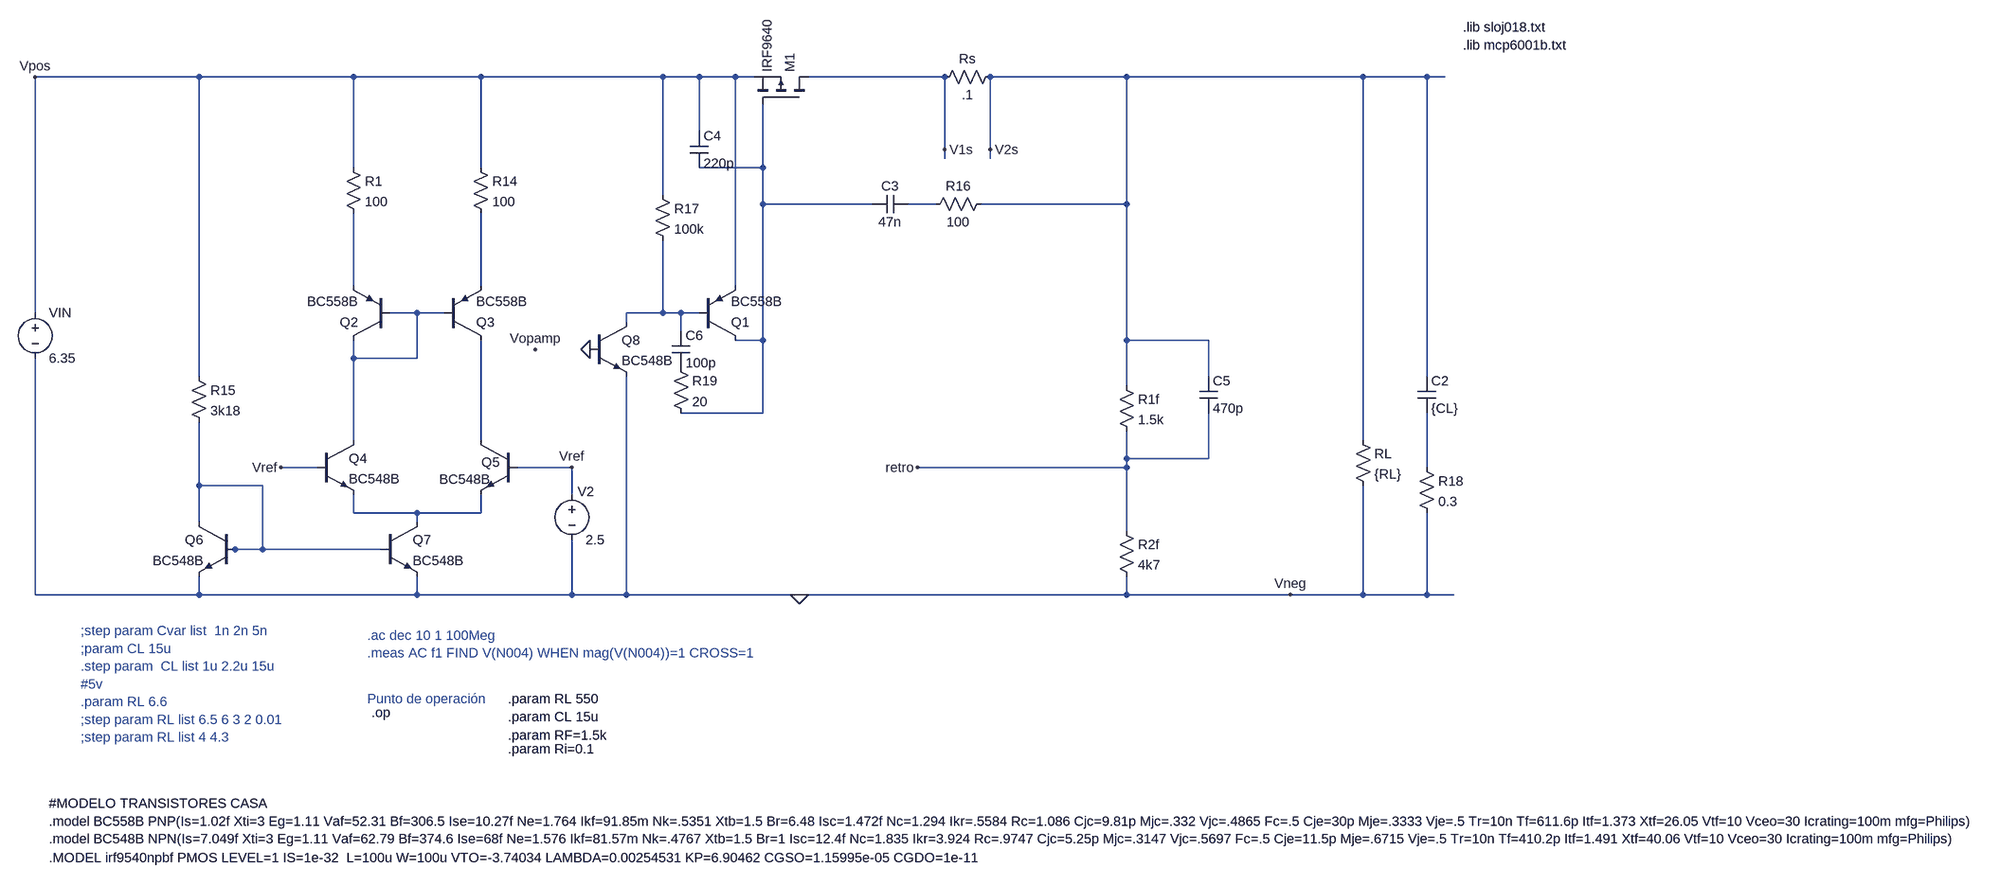
[diagram p0: schematic 2024-10-15 prueba vref caso limite2.asc]
2024-10-15 prueba vref caso limite2.asc, the LTspice schematic file:
Version 4
SHEET 1 6700 2000
WIRE -496 -32 -784 -32
WIRE -224 -32 -496 -32
WIRE 0 -32 -224 -32
WIRE 320 -32 0 -32
WIRE 384 -32 320 -32
WIRE 448 -32 384 -32
WIRE 480 -32 448 -32
WIRE 816 -32 576 -32
WIRE 1136 -32 896 -32
WIRE 1552 -32 1136 -32
WIRE 1664 -32 1552 -32
WIRE 1696 -32 1664 -32
WIRE 384 64 384 -32
WIRE 816 96 816 -32
WIRE 896 96 896 -32
WIRE 816 112 816 96
WIRE 896 112 896 96
WIRE -224 128 -224 -32
WIRE 0 128 0 -32
WIRE 496 128 496 16
WIRE 496 128 384 128
WIRE 320 176 320 -32
WIRE 496 192 496 128
WIRE 688 192 496 192
WIRE 800 192 752 192
WIRE 1136 192 1136 -32
WIRE 1136 192 880 192
WIRE -224 336 -224 208
WIRE 0 336 0 208
WIRE 448 336 448 -32
WIRE -784 384 -784 -32
WIRE -112 384 -160 384
WIRE -64 384 -112 384
WIRE 320 384 320 256
WIRE 320 384 256 384
WIRE 352 384 320 384
WIRE 384 384 352 384
WIRE 256 400 256 384
WIRE 352 416 352 384
WIRE 496 432 496 192
WIRE 496 432 448 432
WIRE 1136 432 1136 192
WIRE 1280 432 1136 432
WIRE 208 448 192 448
WIRE -224 464 -224 432
WIRE -112 464 -112 384
WIRE -112 464 -224 464
WIRE -496 496 -496 -32
WIRE 1280 496 1280 432
WIRE 1664 496 1664 -32
WIRE 1136 512 1136 432
WIRE 496 560 496 432
WIRE 496 560 352 560
WIRE -224 608 -224 464
WIRE 0 608 0 432
WIRE 1552 608 1552 -32
WIRE 1136 640 1136 592
WIRE 1280 640 1280 560
WIRE 1280 640 1136 640
WIRE -288 656 -352 656
WIRE 160 656 64 656
WIRE 1136 656 1136 640
WIRE 1136 656 768 656
WIRE 1664 656 1664 560
WIRE -496 688 -496 576
WIRE -384 688 -496 688
WIRE 160 704 160 656
WIRE -224 736 -224 704
WIRE -112 736 -224 736
WIRE 0 736 0 704
WIRE 0 736 -112 736
WIRE -496 752 -496 688
WIRE -112 752 -112 736
WIRE 1136 768 1136 656
WIRE -432 800 -448 800
WIRE -384 800 -384 688
WIRE -384 800 -432 800
WIRE -176 800 -384 800
WIRE -784 880 -784 464
WIRE -496 880 -496 848
WIRE -496 880 -784 880
WIRE -112 880 -112 848
WIRE -112 880 -496 880
WIRE 160 880 160 784
WIRE 160 880 -112 880
WIRE 256 880 256 496
WIRE 256 880 160 880
WIRE 560 880 256 880
WIRE 1136 880 1136 848
WIRE 1136 880 560 880
WIRE 1424 880 1136 880
WIRE 1552 880 1552 688
WIRE 1552 880 1424 880
WIRE 1664 880 1664 736
WIRE 1664 880 1552 880
WIRE 1712 880 1664 880
FLAG 560 880 0
FLAG -784 -32 Vpos
FLAG 816 96 V1s
FLAG 896 96 V2s
FLAG 1424 880 Vneg
FLAG 160 656 Vref
FLAG -352 656 Vref
FLAG 768 656 retro
FLAG 96 448 Vopamp
FLAG 192 448 0
DATAFLAG 1040 -32 ""
DATAFLAG 96 -32 ""
DATAFLAG 1152 -32 ""
DATAFLAG 1152 -32 ""
DATAFLAG 1152 -32 ""
DATAFLAG 0 576 ""
DATAFLAG 0 576 ""
DATAFLAG 0 576 ""
DATAFLAG -224 464 ""
DATAFLAG -112 736 ""
DATAFLAG 448 -16 "$-V(N001)"
DATAFLAG -496 688 ""
DATAFLAG -496 432 "$-V(N008)"
DATAFLAG -384 800 ""
DATAFLAG -224 304 "$-V(N005)"
DATAFLAG 0 320 "$-V(N001)"
DATAFLAG 0 112 "$-V(N004)"
DATAFLAG 448 320 "$-V(N006)"
DATAFLAG 176 448 ""
DATAFLAG 256 512 ""
DATAFLAG 496 128 ""
DATAFLAG 496 128 ""
DATAFLAG 1136 640 ""
DATAFLAG 1136 640 ""
DATAFLAG -224 288 ""
DATAFLAG -224 288 ""
DATAFLAG 352 384 ""
DATAFLAG 352 384 ""
DATAFLAG 464 -32 "$-V(N001)"
SYMBOL res 1536 592 R0
SYMATTR InstName RL
SYMATTR Value {RL}
SYMBOL voltage -784 368 R0
WINDOW 123 24 124 Left 2
WINDOW 39 0 0 Left 0
SYMATTR InstName VIN
SYMATTR Value 6.35
SYMBOL res 1120 496 R0
SYMATTR InstName R1f
SYMATTR Value 1.5k
SYMBOL res 1120 752 R0
SYMATTR InstName R2f
SYMATTR Value 4k7
SYMBOL res 912 -48 R90
WINDOW 0 0 56 VBottom 2
WINDOW 3 32 56 VTop 2
SYMATTR InstName Rs
SYMATTR Value .1
SYMBOL pnp -160 432 R180
SYMATTR InstName Q2
SYMATTR Value BC558B
SYMBOL pnp -64 432 M180
SYMATTR InstName Q3
SYMATTR Value BC558B
SYMBOL npn -288 608 R0
SYMATTR InstName Q4
SYMATTR Value BC548B
SYMBOL npn 64 608 M0
WINDOW 0 31 39 Left 2
WINDOW 3 48 69 Left 2
SYMATTR InstName Q5
SYMATTR Value BC548B
SYMBOL res -240 112 R0
SYMATTR InstName R1
SYMATTR Value 100
SYMBOL res -16 112 R0
SYMATTR InstName R14
SYMATTR Value 100
SYMBOL res -512 480 R0
SYMATTR InstName R15
SYMATTR Value 3k18
SYMBOL npn -432 752 M0
SYMATTR InstName Q6
SYMATTR Value BC548B
SYMBOL npn -176 752 R0
SYMATTR InstName Q7
SYMATTR Value BC548B
SYMBOL pmos 576 16 M270
SYMATTR InstName M1
SYMATTR Value IRF9640
SYMBOL voltage 160 688 R0
WINDOW 0 10 11 Left 2
WINDOW 123 0 0 Left 0
WINDOW 39 0 0 Left 0
SYMATTR InstName V2
SYMATTR Value 2.5
SYMBOL pnp 384 432 M180
SYMATTR InstName Q1
SYMATTR Value BC558B
SYMBOL npn 192 400 R0
SYMATTR InstName Q8
SYMATTR Value BC548B
SYMBOL res 304 160 R0
SYMATTR InstName R17
SYMATTR Value 100k
SYMBOL cap 1648 496 R0
SYMATTR InstName C2
SYMATTR Value {CL}
SYMBOL cap 752 176 R90
WINDOW 0 0 32 VBottom 2
WINDOW 3 32 32 VTop 2
SYMATTR InstName C3
SYMATTR Value 47n
SYMBOL res 896 176 R90
WINDOW 0 0 56 VBottom 2
WINDOW 3 32 56 VTop 2
SYMATTR InstName R16
SYMATTR Value 100
SYMBOL cap 368 64 R0
SYMATTR InstName C4
SYMATTR Value 220p
SYMBOL cap 1264 496 R0
SYMATTR InstName C5
SYMATTR Value 470p
SYMBOL res 1648 640 R0
SYMATTR InstName R18
SYMATTR Value 0.3
SYMBOL cap 336 416 R0
SYMATTR InstName C6
SYMATTR Value 100p
SYMBOL res 336 464 R0
SYMATTR InstName R19
SYMATTR Value 20
TEXT -192 1088 Left 2 !.op
TEXT -760 1344 Left 2 !.MODEL irf9540npbf PMOS LEVEL=1 IS=1e-32  L=100u W=100u VTO=-3.74034 LAMBDA=0.00254531 KP=6.90462 CGSO=1.15995e-05 CGDO=1e-11
TEXT 48 1064 Left 2 !.param RL 550\n.param CL 15u
TEXT 48 1128 Left 2 !.param RF=1.5k
TEXT -200 1064 Left 2 ;Punto de operación
TEXT 48 1152 Left 2 !.param Ri=0.1
TEXT 1728 -88 Left 2 !.lib mcp6001b.txt
TEXT -760 1248 Left 2 !#MODELO TRANSISTORES CASA\n.model BC558B PNP(Is=1.02f Xti=3 Eg=1.11 Vaf=52.31 Bf=306.5 Ise=10.27f Ne=1.764 Ikf=91.85m Nk=.5351 Xtb=1.5 Br=6.48 Isc=1.472f Nc=1.294 Ikr=.5584 Rc=1.086 Cjc=9.81p Mjc=.332 Vjc=.4865 Fc=.5 Cje=30p Mje=.3333 Vje=.5 Tr=10n Tf=611.6p Itf=1.373 Xtf=26.05 Vtf=10 Vceo=30 Icrating=100m mfg=Philips)\n.model BC548B NPN(Is=7.049f Xti=3 Eg=1.11 Vaf=62.79 Bf=374.6 Ise=68f Ne=1.576 Ikf=81.57m Nk=.4767 Xtb=1.5 Br=1 Isc=12.4f Nc=1.835 Ikr=3.924 Rc=.9747 Cjc=5.25p Mjc=.3147 Vjc=.5697 Fc=.5 Cje=11.5p Mje=.6715 Vje=.5 Tr=10n Tf=410.2p Itf=1.491 Xtf=40.06 Vtf=10 Vceo=30 Icrating=100m mfg=Philips)
TEXT -200 952 Left 2 ;.ac dec 10 1 100Meg\n.meas AC f1 FIND V(N004) WHEN mag(V(N004))=1 CROSS=1
TEXT 1728 -120 Left 2 !.lib sloj018.txt
TEXT -704 944 Left 2 ;;step param Cvar list  1n 2n 5n\n;param CL 15u\n.step param  CL list 1u 2.2u 15u\n#5v\n.param RL 6.6\n;step param RL list 6.5 6 3 2 0.01\n;step param RL list 4 4.3

The netlist it stands for:
* 2024-10-15 prueba vref caso limite2.asc
RL V2s 0 {RL}
VIN Vpos 0 6.35
R1f V2s retro 1.5k
R2f retro 0 4k7
Rs V2s V1s .1
Q2 N005 N005 N003 0 BC558B
Q3 N007 N005 N004 0 BC558B
Q4 N005 Vref N010 0 BC548B
Q5 N007 Vref N010 0 BC548B
R1 Vpos N003 100
R14 Vpos N004 100
R15 Vpos N009 3k18
Q6 N009 N009 0 0 BC548B
Q7 N010 N009 0 0 BC548B
M1 V1s N001 Vpos Vpos IRF9640
V2 Vref 0 2.5
Q1 N001 N006 Vpos 0 BC558B
Q8 N006 0 0 0 BC548B
R17 Vpos N006 100k
C2 V2s N008 {CL}
C3 N002 N001 47n
R16 V2s N002 100
C4 Vpos N001 220p
C5 V2s retro 470p
R18 N008 0 0.3
C6 N006 P001 100p
R19 P001 N001 20
.model NPN NPN
.model PNP PNP
.lib standard.bjt
.model NMOS NMOS
.model PMOS PMOS
.lib standard.mos
.op
.MODEL irf9540npbf PMOS LEVEL=1 IS=1e-32  L=100u W=100u VTO=-3.74034 LAMBDA=0.00254531 KP=6.90462 CGSO=1.15995e-05 CGDO=1e-11
.param RL 550
.param CL 15u
.param RF=1.5k
* Punto de operación
.param Ri=0.1
.lib mcp6001b.txt
#MODELO TRANSISTORES CASA
.model BC558B PNP(Is=1.02f Xti=3 Eg=1.11 Vaf=52.31 Bf=306.5 Ise=10.27f Ne=1.764 Ikf=91.85m Nk=.5351 Xtb=1.5 Br=6.48 Isc=1.472f Nc=1.294 Ikr=.5584 Rc=1.086 Cjc=9.81p Mjc=.332 Vjc=.4865 Fc=.5 Cje=30p Mje=.3333 Vje=.5 Tr=10n Tf=611.6p Itf=1.373 Xtf=26.05 Vtf=10 Vceo=30 Icrating=100m mfg=Philips)
.model BC548B NPN(Is=7.049f Xti=3 Eg=1.11 Vaf=62.79 Bf=374.6 Ise=68f Ne=1.576 Ikf=81.57m Nk=.4767 Xtb=1.5 Br=1 Isc=12.4f Nc=1.835 Ikr=3.924 Rc=.9747 Cjc=5.25p Mjc=.3147 Vjc=.5697 Fc=.5 Cje=11.5p Mje=.6715 Vje=.5 Tr=10n Tf=410.2p Itf=1.491 Xtf=40.06 Vtf=10 Vceo=30 Icrating=100m mfg=Philips)
* .ac dec 10 1 100Meg
* .meas AC f1 FIND V(N004) WHEN mag(V(N004))=1 CROSS=1
.lib sloj018.txt
* ;step param Cvar list  1n 2n 5n
* ;param CL 15u
* .step param  CL list 1u 2.2u 15u
* #5v
* .param RL 6.6
* ;step param RL list 6.5 6 3 2 0.01
* ;step param RL list 4 4.3
.backanno
.end